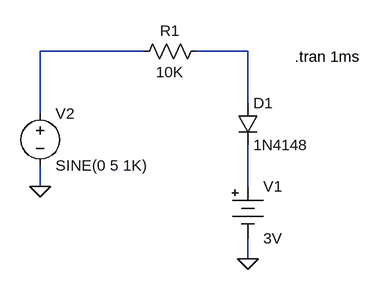
[diagram p0: schematic CLIPPING-Circuit.asc]
CLIPPING-Circuit.asc, the LTspice schematic file:
Version 4
SHEET 1 880 680
WIRE 160 64 0 64
WIRE 320 64 240 64
WIRE 320 144 320 64
WIRE 0 160 0 64
WIRE 0 272 0 240
WIRE 320 272 320 208
WIRE 320 384 320 352
FLAG 0 272 0
FLAG 320 384 0
SYMBOL res 256 48 R90
WINDOW 0 0 56 VBottom 2
WINDOW 3 32 56 VTop 2
SYMATTR InstName R1
SYMATTR Value 10K
SYMBOL diode 304 144 R0
SYMATTR InstName D1
SYMATTR Value 1N4148
SYMBOL Misc\\battery 320 256 R0
WINDOW 123 0 0 Left 0
WINDOW 39 0 0 Left 0
SYMATTR InstName V1
SYMATTR Value 3V
SYMBOL voltage 0 144 R0
WINDOW 123 0 0 Left 0
WINDOW 39 0 0 Left 0
SYMATTR InstName V2
SYMATTR Value SINE(0 5 1K)
TEXT 392 72 Left 2 !.tran 1ms

The netlist it stands for:
* CLIPPING-Circuit.asc
R1 N002 N001 10K
D1 N002 N003 1N4148
V1 N003 0 3V
V2 N001 0 SINE(0 5 1K)
.model D D
.lib standard.dio
.tran 1ms
.backanno
.end